# EAGLE design pickit2 (EAGLE 7.2.0)
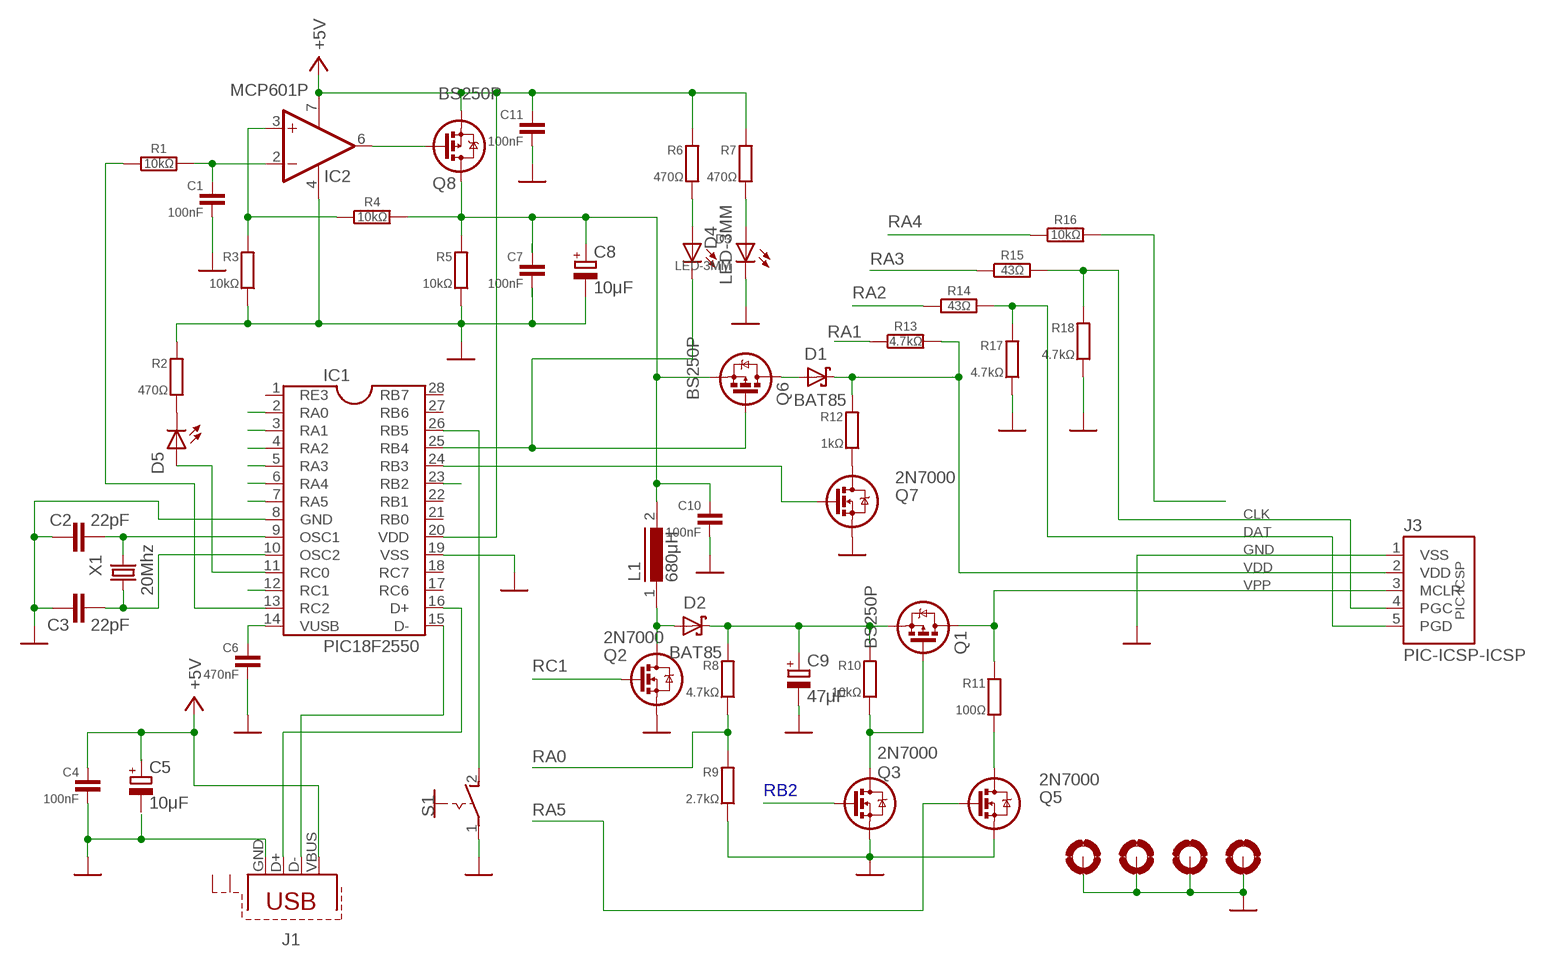
[diagram p0: schematic, sheet 1]

## Parts
C1  100nF  C050-025X075/V  [C050-025X075/V]
C2  22pF  C2.5/2  [C2.5-2]
C3  22pF  C2.5/2  [C2.5-2]
C4  100nF  C050-025X075/V  [C050-025X075/V]
C5  10μF  CPOLE2.5-5  [E2,5-5]
C6  470nF  C050-025X075/V  [C050-025X075/V]
C7  100nF  C050-025X075/V  [C050-025X075/V]
C8  10μF  CPOLE2.5-5  [E2,5-5]
C9  47μF  CPOLE2.5-5  [E2,5-5]
C10  100nF  C050-025X075/V  [C050-025X075/V]
C11  100nF  C050-025X075/V  [C050-025X075/V]
D1  BAT85  BAT42M  [DO35-10M]
D2  BAT85  BAT42M  [DO35-10M]
D3  LED-3MM  [LED_3MM]
D4  LED-3MM  [LED_3MM]
D5  LED5MM  [LED5MM]
H1  MOUNT-PAD-ROUND2.8  [2,8-PAD]
H2  MOUNT-PAD-ROUND2.8  [2,8-PAD]
H3  MOUNT-PAD-ROUND2.8  [2,8-PAD]
H4  MOUNT-PAD-ROUND2.8  [2,8-PAD]
IC1  PIC18F2550  [DIL28]
IC2  MCP601P  MCP601M  [DIL08M]
J1  PN61729-S  [PN61729-S]
J3  PIC-ICSP-ICSP  [PIC-ICSP]
L1  680μH  82114RM  [R0608]
Q1  BS250P  [TO92]
Q2  2N7000  [TO92]
Q3  2N7000  [TO92]
Q5  2N7000  [TO92]
Q6  BS250P  [TO92]
Q7  2N7000  [TO92]
Q8  BS250P  [TO92]
R1  10kΩ  R-H0204/10  [0204/10]
R2  470Ω  R0204/10  [0204/10]
R3  10kΩ  R0204/10  [0204/10]
R4  10kΩ  R-H0204/10  [0204/10]
R5  10kΩ  R0204/10  [0204/10]
R6  470Ω  R0204/10  [0204/10]
R7  470Ω  R0204/10  [0204/10]
R8  4.7kΩ  R0204/10  [0204/10]
R9  2.7kΩ  R0204/10  [0204/10]
R10  10kΩ  R0204/10  [0204/10]
R11  100Ω  R0204/10  [0204/10]
R12  1kΩ  R0204/10  [0204/10]
R13  4.7kΩ  R-H0204/10  [0204/10]
R14  43Ω  R-H0204/10  [0204/10]
R15  43Ω  R-H0204/10  [0204/10]
R16  10kΩ  R-H0204/10  [0204/10]
R17  4.7kΩ  R0204/10  [0204/10]
R18  4.7kΩ  R0204/10  [0204/10]
S1  PB-1P-1T  [PB-1P1T]
X1  20Mhz  CRYSTALHC49  [HC49]

## Nets
+5V: C4.1 C5.+ C11.1 IC1.20(VDD) IC2.7(V+) J1.VBUS Q8.3(S) R6.1 R7.1
GND: C1.2 C2.1 C3.2 C4.2 C6.2 C7.2 C8.- C9.- C10.2 C11.2 D3.K(C) H1.B2,8(MOUNT) H2.B2,8(MOUNT) H3.B2,8(MOUNT) H4.B2,8(MOUNT) IC1.8(GND) IC1.19(VSS) IC2.4(V-) J1.GND J3.1(VSS) Q2.1(S) Q3.1(S) Q5.1(S) Q7.1(S) R2.1 R3.2 R5.2 R9.2 R17.2 R18.2 S1.1(P)
N$1: D4.A R6.2
N$2: D2.A L1.1 Q2.3(D)
N$3: IC2.6(OUT) Q8.2(G)
N$4: C9.+ D2.C Q1.3(S) R8.1 R10.1
N$5: D3.A R7.2
N$6: D5.K(C) R2.2
N$8: Q5.3(D) R11.2
N$9: IC1.15(D-) J1.D-
N$12: IC1.16(D+) J1.D+
N$14: Q1.2(G) Q3.3(D) R10.2
N$16: J3.3(MCLR) Q1.1(D) R11.1
N$17: D1.A Q6.1(D)
N$18: D1.C J3.2(VDD) R12.1 R13.2
N$19: Q7.3(D) R12.2
N$20: D4.K(C) IC1.25(RB4) Q6.2(G)
N$21: C2.2 IC1.9(OSC1) X1.2
N$22: C6.1 IC1.14(VUSB)
N$24: IC1.24(RB3) Q7.2(G)
N$25: J3.5(PGD) R14.2 R17.1
N$26: J3.4(PGC) R15.2 R18.1
N$27: R16.2
N$30: IC2.3(+IN) R3.1 R4.1
N$33: C7.1 C8.+ C10.1 L1.2 Q6.3(S) Q8.1(D) R4.2 R5.1
N$34: C3.1 IC1.10(OSC2) X1.1
N$35: C1.1 IC2.2(-IN) R1.2
RA0: IC1.2(RA0) R8.2 R9.1
RA1: IC1.3(RA1) R13.1
RA2: IC1.4(RA2) R14.1
RA3: IC1.5(RA3) R15.1
RA4: IC1.6(RA4) R16.1
RA5: IC1.7(RA5) Q5.2(G)
RB2: IC1.23(RB2) Q3.2(G)
RB5: IC1.26(RB5) S1.2(S)
RC0: D5.A IC1.11(RC0)
RC1: IC1.12(RC1) Q2.2(G)
RC2: IC1.13(RC2) R1.1
Unconnected: C5.- IC1.1(RE3) IC1.17(RC6) IC1.18(RC7) IC1.21(RB0) IC1.22(RB1) IC1.27(RB6) IC1.28(RB7) J1.S1 J1.S2

## Notes on the sheet
- CLK
- DAT
- GND
- VDD
- VPP
- RB2

## Library data of the parts
C1 C4 C6 C7 C10 C11 = c:C: CAPACITOR, European symbol
C2 C3 = capacitor-wima:C: CAPACITOR naming: grid - package width
C5 C8 C9 = c:CPOL: POLARIZED CAPACITOR, European symbol
D1 D2 = diode:BAT42: DIODE barrier diode
D3 D4 = d:LED
D5 = led:LED: LED OSRAM: - CHIPLED LG R971, LG N971, LY N971, LG Q971, LY Q971, LO R971, LY R971 LH N974, LH R974 LS Q976, LO Q976, LY Q976 LO Q996 - Hyper CHIPLED LW Q18S LB Q993, LB Q99A, LB R99A - SideLED LS A670, LO A670, LY A670, LG A670, LP A670 LB A673, LV A673, LT A673, LW A673 LH A674 LY A675 LS A676, LA A676, LO A676, LY A676, LW A676 LS A679, LY A679, LG A679 - Hyper Micro SIDELED® LS Y876, LA Y876, LO Y876, LY Y876 LT Y87S - SmartLED LW L88C, LW L88S LB L89C, LB L89S, LG L890 LS L89K, LO L89K, LY L89K LS L896, LA L896, LO L896, LY L896 - TOPLED LS T670, LO T670, LY T670, LG T670, LP T670 LSG T670, LSP T670, LSY T670, LOP T670, LYG T670 LG T671, LOG T671, LSG T671 LB T673, LV T673, LT T673, LW T673 LH T674 LS T676, LA T676, LO T676, LY T676, LB T676, LH T676, LSB T676, LW T676 LB T67C, LV T67C, LT T67C, LS T67K, LO T67K, LY T67K, LW E67C LS E67B, LA E67B, LO E67B, LY E67B, LB E67C, LV E67C, LT E67C LW T67C LS T679, LY T679, LG T679 LS T770, LO T770, LY T770, LG T770, LP T770 LB T773, LV T773, LT T773, LW T773 LH T774 LS E675, LA E675, LY E675, LS T675 LS T776, LA T776, LO T776, LY T776, LB T776 LHGB T686 LT T68C, LB T68C - Hyper Mini TOPLED® LB M676 - Mini TOPLED Santana® LG M470 LS M47K, LO M47K, LY M47K Source: http://www.osram.convergy.de LUXEON: - LUMILED® LXK2-PW12-R00, LXK2-PW12-S00, LXK2-PW14-U00, LXK2-PW14-V00 LXK2-PM12-R00, LXK2-PM12-S00, LXK2-PM14-U00 LXK2-PE12-Q00, LXK2-PE12-R00, LXK2-PE12-S00, LXK2-PE14-T00, LXK2-PE14-U00 LXK2-PB12-K00, LXK2-PB12-L00, LXK2-PB12-M00, LXK2-PB14-N00, LXK2-PB14-P00, LXK2-PB14-Q00 LXK2-PR12-L00, LXK2-PR12-M00, LXK2-PR14-Q00, LXK2-PR14-R00 LXK2-PD12-Q00, LXK2-PD12-R00, LXK2-PD12-S00 LXK2-PH12-R00, LXK2-PH12-S00 LXK2-PL12-P00, LXK2-PL12-Q00, LXK2-PL12-R00 Source: www.luxeon.com KINGBRIGHT: KA-3528ASYC Source: www.kingbright.com
H1-H4 = holes:MOUNT-PAD-ROUND: MOUNTING PAD, round
IC1 = pic18f2455:PIC18F2550
IC2 = linear:MCP601: Single Op Amp 2.7V to 6.0V Single Supply CMOS Source: http://ww1.microchip.com/downloads/en/DeviceDoc/21314g.pdf
J1 = con-berg:PN61729-S: BERG USB connector
J3 = pinconn:PIC-ICSP
L1 = inductors:82114R: INDUCTOR
Q1 Q6 Q8 = t:BS250P
Q2 Q3 Q5 Q7 = t:2N7000
R1 R4 R13-R16 = r:R-H
R2 R3 R5-R12 R17 R18 = r:R: RESISTOR, European symbol
S1 = sw:PB-1P-1T
X1 = q:CRYSTAL

## Board
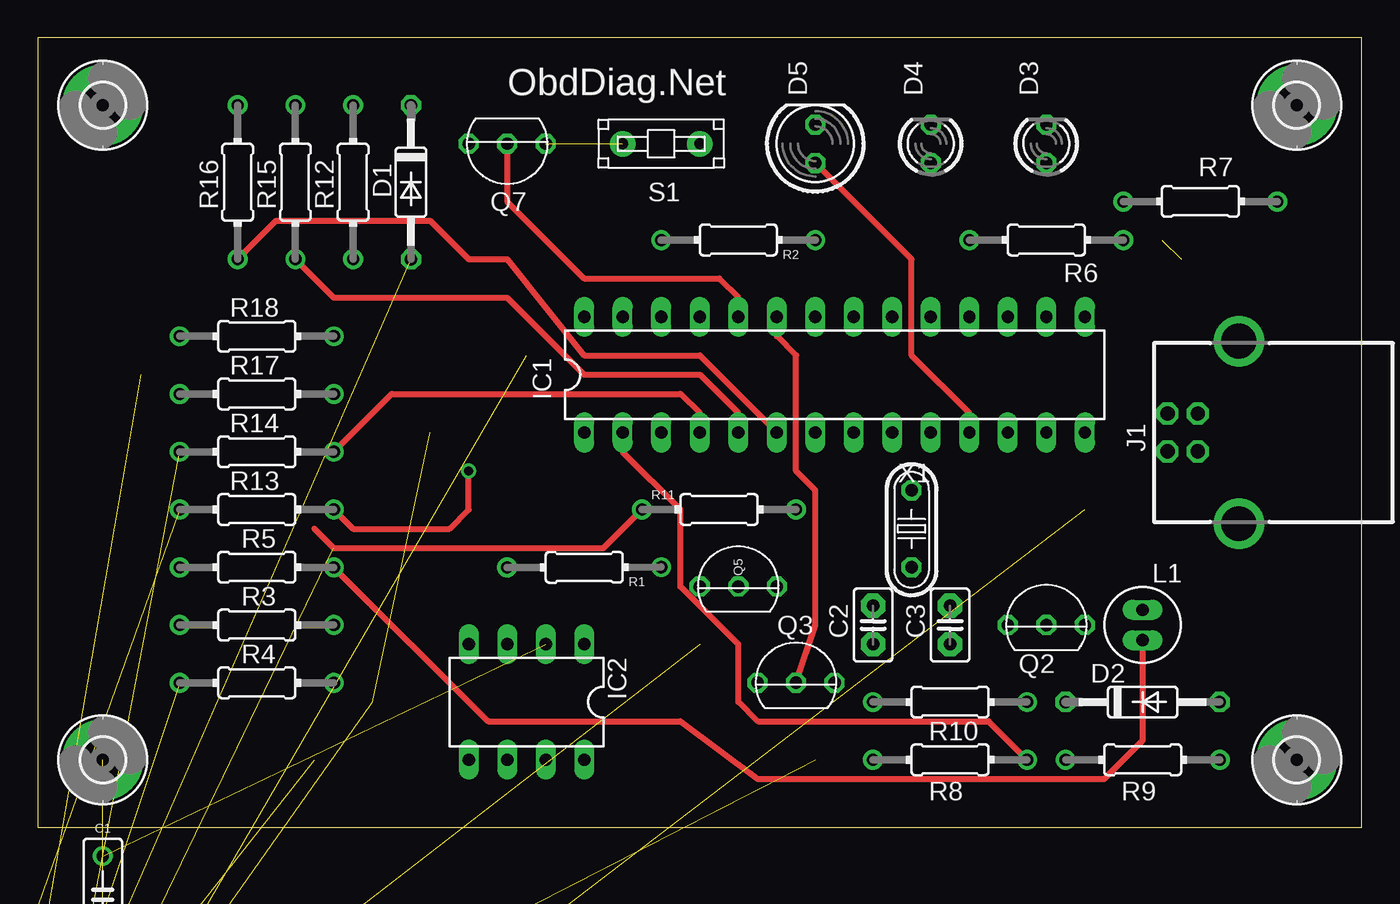
[diagram p1: board, top side]
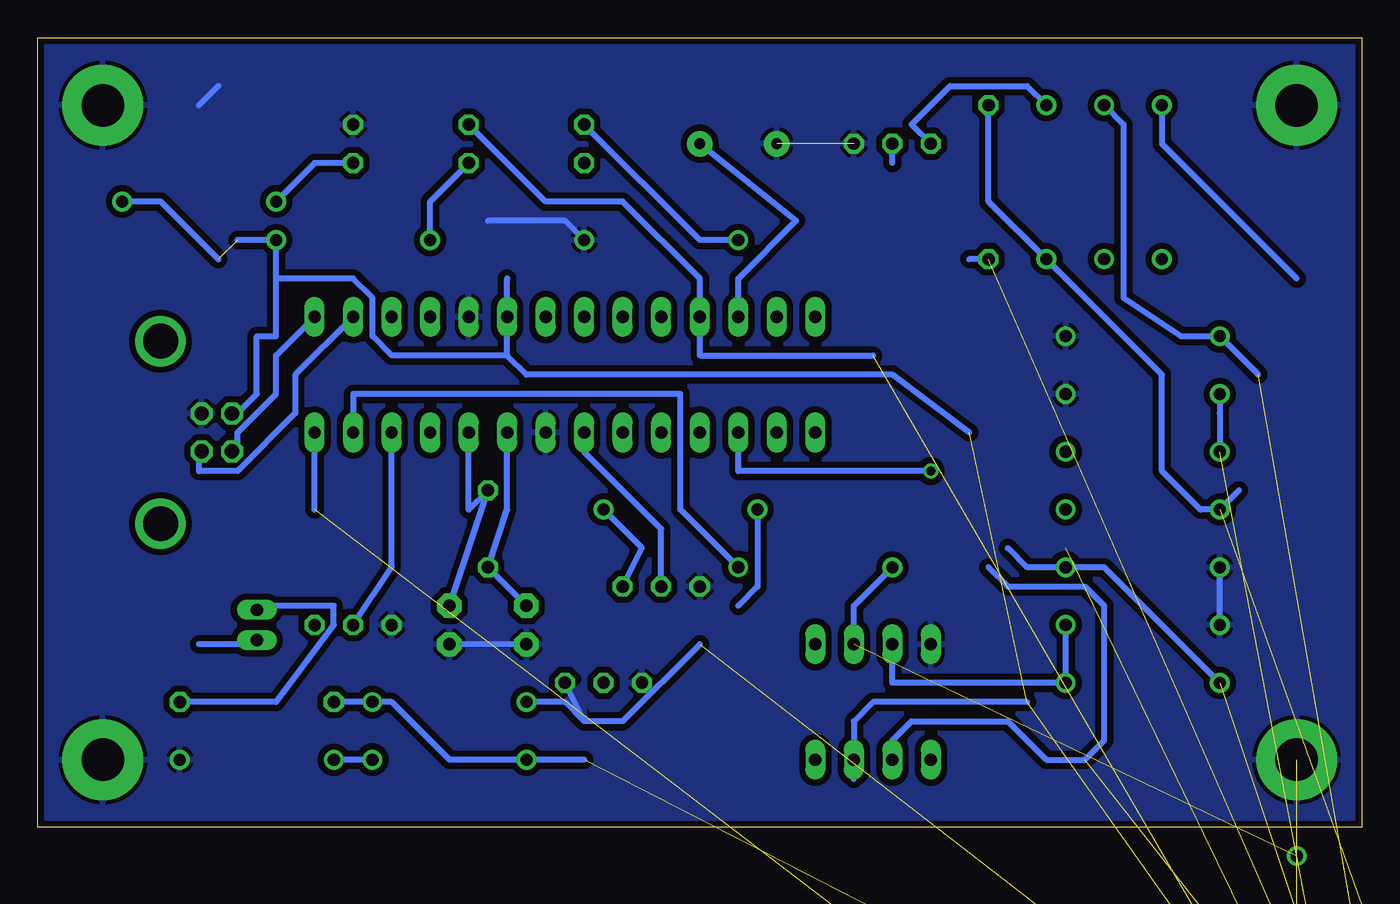
[diagram p2: board, bottom side, seen from below]

Size 87.3 x 52.06 mm. Coordinates in mm from the lower left corner, seen from the top.
Outline: 0,0 87.3,0 87.3,52.06 0,52.06 0,0
Copper layers (1*16): Top 0.035mm / dielectric 1.5mm / Bottom 0.035mm
Design rules "default *": minimum track width 10mil, minimum drill 24mil, track to track 8mil, track to pad 8mil, pad to pad 8mil, via to via 8mil, smd to smd 8mil, copper to edge 0.4mm, drill to drill 8mil, minimum pad ring 10mil, minimum via ring 8mil, stop-mask expansion 4mil, vias tented up to drill 0mil, thermal gap 10mil

### Footprints (pad centres in the part's own frame; a part is rotated, then mirrored left to right if it is on the bottom)
C050-025X075/V = drill 0.8: 1 0,2.54; 2 0,-2.54
C2.5-2 = drill 0.813 pad 1.6 octagon: 1 -1.27,0; 2 1.27,0
E2,5-5 = drill 0.813 pad 1.6: + 1.27,0 | drill 0.813 pad 1.6 octagon: - -1.27,0
DO35-10M = drill 0.813 octagon: A 5.08,0; C -5.08,0
LED_3MM = drill 0.813 octagon: A -1.27,0; K 1.27,0
LED5MM = drill 0.813 octagon: A -1.27,0; K 1.27,0
2,8-PAD = drill 2.8 pad 5.334: B2,8 0,0
DIL28 = drill 0.813 long: 1 -16.51,-3.81; 2 -13.97,-3.81; 3 -11.43,-3.81; 4 -8.89,-3.81; 5 -6.35,-3.81; 6 -3.81,-3.81; 7 -1.27,-3.81; 8 1.27,-3.81; 9 3.81,-3.81; 10 6.35,-3.81; 11 8.89,-3.81; 12 11.43,-3.81; 13 13.97,-3.81; 14 16.51,-3.81; 15 16.51,3.81; 16 13.97,3.81; 17 11.43,3.81; 18 8.89,3.81; 19 6.35,3.81; 20 3.81,3.81; 21 1.27,3.81; 22 -1.27,3.81; 23 -3.81,3.81; 24 -6.35,3.81; 25 -8.89,3.81; 26 -11.43,3.81; 27 -13.97,3.81; 28 -16.51,3.81
DIL08M = drill 0.813 long: 1 -3.81,-3.81; 2 -1.27,-3.81; 3 1.27,-3.81; 4 3.81,-3.81; 5 3.81,3.81; 6 1.27,3.81; 7 -1.27,3.81; 8 -3.81,3.81
PN61729-S = drill 0.95 octagon: D+ -1.25,2.71; D- -1.25,4.71; GND 1.25,2.71; VBUS 1.25,4.71 | drill 2.3 pad 2.9: S1 -6.02,0; S2 6.02,0
PIC-ICSP = drill 0.8 pad 1.778 square: 1 0,0 | drill 0.8 pad 1.778 octagon: 2 2.54,0; 3 5.08,0; 4 7.62,0; 5 10.16,0
R0608 = drill 0.813 long: 1 0,1; 2 0,-1
TO92 = drill 0.813 octagon: 1 -2.54,0; 2 0,0; 3 2.54,0
0204/10 = drill 0.8: 1 -5.08,0; 2 5.08,0
PB-1P1T = drill 0.7 pad 1.676: 1 2.54,0; 2 -2.54,0
HC49 = drill 0.813 octagon: 1 0,-2.54; 2 0,2.54

### Placement (x,y rotation side)
C1  4.28,-4.45 0 top
C2  55.08,13.33 90 top
C3  60.16,13.33 270 top
C4  -13.5,-19.69 0 top  (outside the outline)
C5  -7.15,-50.17 0 top  (outside the outline)
C6  -17.31,-47.63 0 top  (outside the outline)
C7  -5.88,-19.69 0 top  (outside the outline)
C8  -7.15,-36.2 0 top  (outside the outline)
C9  -7.15,-42.55 0 top  (outside the outline)
C10  -2.07,-14.61 0 top  (outside the outline)
C11  -9.69,-19.69 0 top  (outside the outline)
D1  24.6,42.54 270 top
D2  72.86,8.25 0 top
D3  66.51,45.08 90 top
D4  58.89,45.08 90 top
D5  51.27,45.08 90 top
H1  4.28,47.62 0 top
H2  4.28,4.44 0 top
H3  83.02,47.62 0 top
H4  83.02,4.44 0 top
IC1  52.54,29.84 0 top
IC2  32.22,8.25 180 top
J1  79.21,26.03 90 top
J3  -10.96,-28.58 0 top  (outside the outline)
L1  72.86,13.33 0 top
Q1  4.28,-18.42 0 top  (outside the outline)
Q2  66.51,13.33 0 top
Q3  50,9.52 0 top
Q5  46.19,15.87 0 top
Q6  0.47,-23.5 0 top  (outside the outline)
Q7  30.95,45.08 180 top
Q8  4.28,-13.34 0 top  (outside the outline)
R1  36.03,17.14 180.1 top
R2  46.19,38.73 180 top
R3  14.44,13.33 180 top
R4  14.44,9.52 180 top
R5  14.44,17.14 180 top
R6  66.51,38.73 180 top
R7  76.67,41.27 180 top
R8  60.16,4.44 0.1 top
R9  72.86,4.44 0 top
R10  60.16,8.25 180 top
R11  44.92,20.95 0 top
R12  20.79,42.54 90 top
R13  14.44,20.95 180 top
R14  14.44,24.76 180 top
R15  16.98,42.54 90 top
R16  13.17,42.54 90 top
R17  14.44,28.57 0 top
R18  14.44,32.38 0 top
S1  41.11,45.08 180 top
X1  57.62,19.68 180 top

### Tracks (layer width: path | path; a pad name or v marks a point on that pad's centre or on a via)
+5V  (6 unrouted)
  Bottom 0.406: 56.35,31.11 63.97,31.11 65.24,32.38 65.24,34.92 66.51,36.19 71.59,36.19 | 56.35,36.19 IC1.20 56.35,31.11 | 33.49,3.17 IC2.7 33.49,6.98 32.22,8.25 22.06,8.25 | 25.87,26.03 30.95,29.84 55.08,29.84 56.35,31.11 | 74.13,27.3 | 74.13,27.3 72.86,28.57 72.86,32.38 71.59,32.38 71.59,36.19 | 71.59,36.19 R6.1 74.13,38.73 | 75.4,37.46 79.21,41.27 R7.1
GND  (10 unrouted)
  Bottom 0.406: C2.1 C3.2 | 76.67,47.62 75.4,48.89 | R2.1 52.54,40 57.62,40 | R3.2 R5.2
  pour Bottom (isolate 0.406): 0.47,51.43 86.83,51.43 86.83,0.63 0.47,0.63
N$1
  Bottom 0.406: D4.A 61.43,41.27 R6.2
N$2
  Bottom 0.406: D2.A 71.59,8.25 67.78,13.33 67.78,14.6 72.86,14.6
N$3  (1 unrouted)
  Bottom 0.406: IC2.6 30.95,5.71 29.68,6.98 23.33,6.98 20.79,4.44 18.25,4.44 16.98,5.71 16.98,14.6 18.25,15.87 23.33,15.87 24.6,17.14
N$4  (2 unrouted)
  Bottom 0.406: 60.16,4.44 R8.1 51.27,4.44 | D2.C R10.1 63.97,8.25 60.16,4.44 | 60.16,4.44
N$5
  Bottom 0.406: D3.A 69.05,43.81 R7.2
N$6
  Bottom 0.406: R2.2 43.65,38.73 D5.K
N$8
  Bottom 0.406: Q5.3 47.46,18.41 R11.2
N$9
  Bottom 0.406: 74.13,24.76 74.13,26.03 71.59,28.57 71.59,31.11 IC1.15 | 74.13,24.76
N$12
  Bottom 0.406: 76.67,24.76 76.67,23.49 74.13,23.49 70.32,27.3 70.32,29.84 IC1.16
N$14  (1 unrouted)
  Bottom 0.406: R10.2 52.54,8.25 51.27,6.98 | 51.27,6.98 48.73,6.98 43.65,12.06 | 51.27,6.98 Q3.3
  pour Bottom (no thermals): 51.27,6.98 52.54,8.25 51.27,9.52
N$16  (2 unrouted)
  Top 0.406: R11.1 37.3,18.41 19.52,18.41 18.25,19.68
  Bottom 0.406: 41.11,14.6 39.84,15.87 R11.1
N$17  (1 unrouted)
  Bottom 0.406: D1.A 25.87,37.46
N$18  (1 unrouted)
  Bottom 0.406: 8.09,22.22 R13.2 10.63,20.95 13.17,23.49 13.17,29.84 R12.1 24.6,41.27 D1.C
N$19
  Bottom 0.406: Q7.3 29.68,46.35 27.14,48.89 22.06,48.89 R12.2
N$20  (1 unrouted)
  Bottom 0.406: D4.K 53.81,41.27 48.73,41.27 43.65,36.19 IC1.25 43.65,31.11 32.22,31.11
N$21
  Bottom 0.406: IC1.9 56.35,20.95 X1.2 C2.2 | C2.2
N$22  (1 unrouted)
  Bottom 0.406: 69.05,20.95 IC1.14
N$24
  Top 0.406: IC1.24 46.19,34.92 44.92,36.19 36.03,36.19 30.95,41.27 Q7.2
  Bottom 0.406: 30.95,43.81 Q7.2
N$25  (1 unrouted)
  Bottom 0.406: R17.1 9.36,27.3 R14.2
N$26  (1 unrouted)
  Bottom 0.406: 6.82,29.84 R18.1 11.9,32.38 15.71,34.92 15.71,46.35 R15.2
N$27
  Bottom 0.406: R16.2 13.17,45.08 4.28,36.19
N$30
  Bottom 0.406: R3.1 R4.1 30.95,9.52 IC2.3
N$33  (5 unrouted)
  Top 0.406: R5.1 29.68,6.98 42.38,6.98 47.46,3.17 70.32,3.17 72.86,5.71 72.86,12.06
  Bottom 0.406: 72.86,12.06 76.67,12.06 | R4.2 16.98,17.14 R5.1 22.06,17.14 23.33,18.41
  pour Bottom: 23.33,24.76 29.68,31.11 23.33,31.11
N$34
  Bottom 0.406: IC1.10 58.89,20.95 X1.1 C3.1 | C3.1
N$35  (1 unrouted)
  Bottom 0.406: R1.2 | R1.2 33.49,14.6 IC2.2
RA0
  Top 0.406: IC1.2 38.57,24.76 42.38,20.95 42.38,15.87 46.19,12.06 46.19,8.25 47.46,6.98 62.7,6.98 R8.2
  Bottom 0.406: R8.2 R9.1 | R8.2
RA1  (via drill 0.6)
  Top 0.406: v28.41,23.49 28.41,20.95 27.14,19.68 20.79,19.68 R13.1
  Bottom 0.406: IC1.3 41.11,23.49 v28.41,23.49
RA2
  Top 0.406: IC1.4 43.65,27.3 42.38,28.57 23.33,28.57 R14.1
RA3
  Top 0.406: IC1.5 46.19,27.3 43.65,29.84 36.03,29.84 30.95,34.92 19.52,34.92 R15.1
RA4
  Top 0.406: IC1.6 43.65,31.11 36.03,31.11 30.95,37.46 28.41,37.46 25.87,40 15.71,40 R16.1
RA5
  Bottom 0.406: IC1.7 51.27,24.76 46.19,19.68 Q5.2
RB2
  Top 0.406: IC1.23 48.73,32.38 50,31.11 50,23.49 51.27,22.22 51.27,13.33 Q3.2
RB5
  Bottom 0.406: IC1.26 41.11,36.19 37.3,40 S1.2
RC0
  Top 0.406: IC1.11 61.43,27.3 57.62,31.11 57.62,37.46 D5.A
RC1
  Bottom 0.406: Q2.2 63.97,17.14 IC1.12
RC2
  Bottom 0.254: R1.1
  Bottom 0.406: IC1.13 66.51,28.57 44.92,28.57 44.92,20.95 R1.1

### Text on the board
tNames: ObdDiag.Net